# Altium schematic sheet MARS_MIO.SchDoc: My title
size A3; Organization: University of California; Address1: 475 Portola Plaza; Address2: Los Angeles, CA 90095; Revision: R01; SheetNumber: 1; SheetTotal: 1
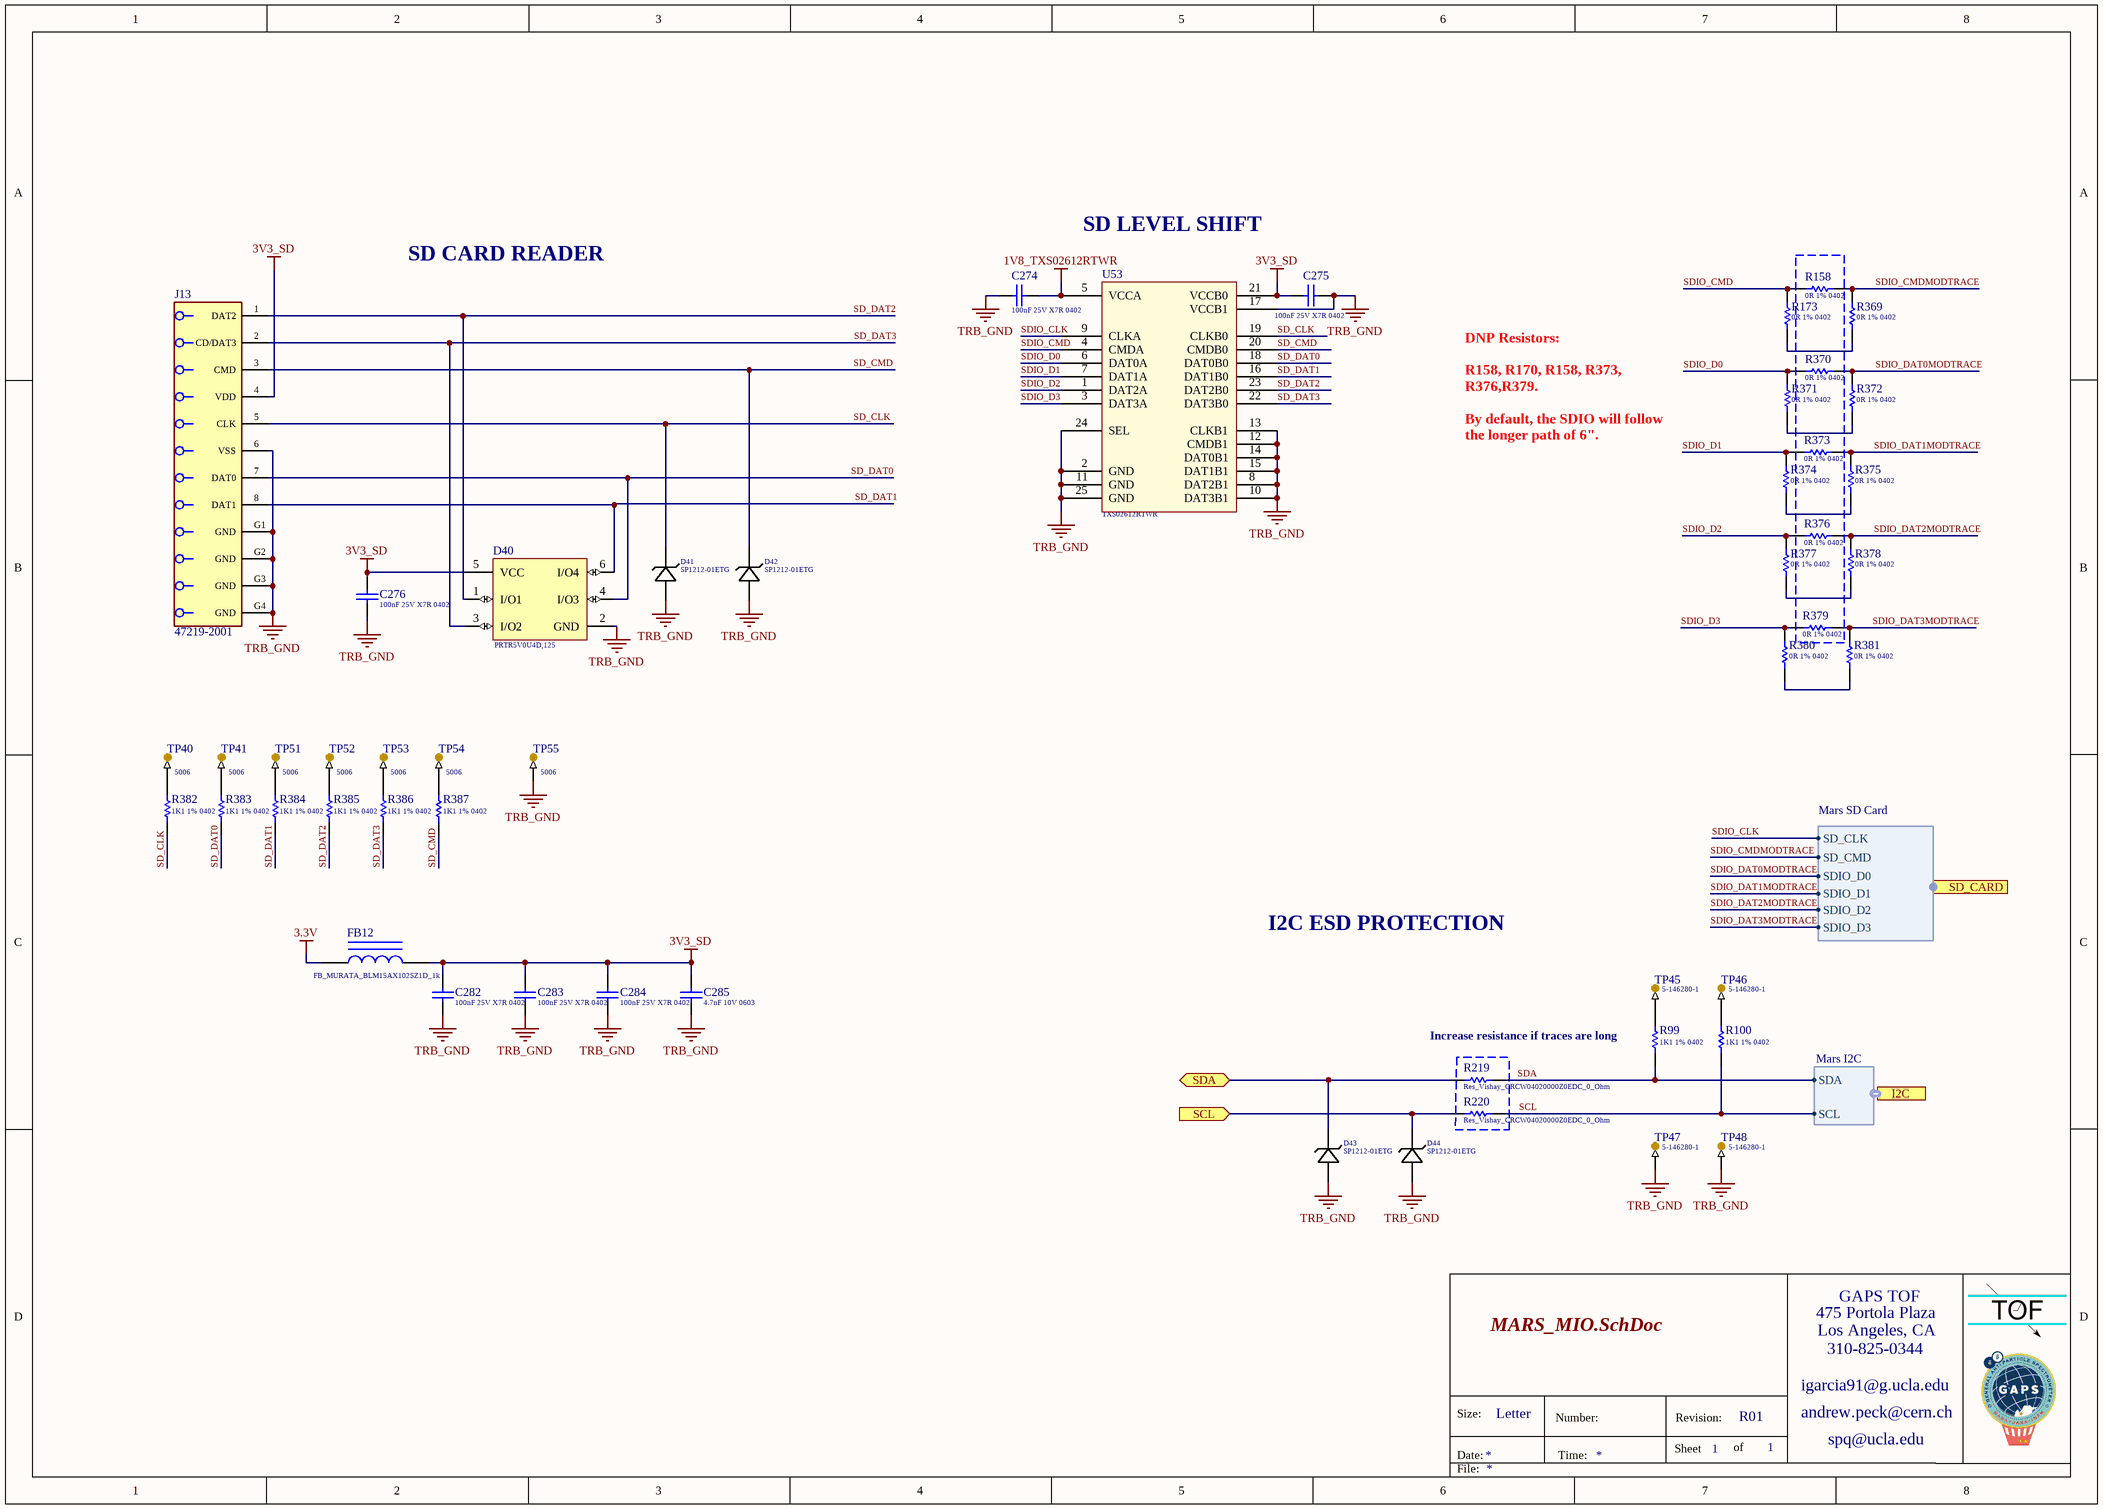
[diagram p0: MARS_MIO.SchDoc]

## Parts
C274  Capacitance: 100nF 25V X7R 0402  [Cap_Taiyo_Yuden_TMK105B7104KV-FR_100nF]  (hidden comment: Cap_Taiyo_Yuden_TMK105B7104KV-FR_100nF)
C275  Capacitance: 100nF 25V X7R 0402  [Cap_Taiyo_Yuden_TMK105B7104KV-FR_100nF]  (hidden comment: Cap_Taiyo_Yuden_TMK105B7104KV-FR_100nF)
C276  Capacitance: 100nF 25V X7R 0402  [Cap_Taiyo_Yuden_TMK105B7104KV-FR_100nF]  (hidden comment: Cap_Taiyo_Yuden_TMK105B7104KV-FR_100nF)
C282  Capacitance: 100nF 25V X7R 0402  [Cap_Taiyo_Yuden_TMK105B7104KV-FR_100nF]  (hidden comment: Cap_Taiyo_Yuden_TMK105B7104KV-FR_100nF)
C283  Capacitance: 100nF 25V X7R 0402  [Cap_Taiyo_Yuden_TMK105B7104KV-FR_100nF]  (hidden comment: Cap_Taiyo_Yuden_TMK105B7104KV-FR_100nF)
C284  Capacitance: 100nF 25V X7R 0402  [Cap_Taiyo_Yuden_TMK105B7104KV-FR_100nF]  (hidden comment: Cap_Taiyo_Yuden_TMK105B7104KV-FR_100nF)
C285  4.7nF 10V 0603  [CAPC0603(1608)100_L]
D40  PRTR5V0U4D,125  [PRTR5V0U4D,125]
D41  Series: SP1212-01ETG  [5V_ESD_Littlefuse_SP1212-01ETG_30kV]  (hidden comment: 5V_ESD_Littlefuse_SP1212-01ETG_30kV)
D42  Series: SP1212-01ETG  [5V_ESD_Littlefuse_SP1212-01ETG_30kV]  (hidden comment: 5V_ESD_Littlefuse_SP1212-01ETG_30kV)
D43  Series: SP1212-01ETG  [5V_ESD_Littlefuse_SP1212-01ETG_30kV]  (hidden comment: 5V_ESD_Littlefuse_SP1212-01ETG_30kV)
D44  Series: SP1212-01ETG  [5V_ESD_Littlefuse_SP1212-01ETG_30kV]  (hidden comment: 5V_ESD_Littlefuse_SP1212-01ETG_30kV)
FB12  FB_MURATA_BLM15AX102SZ1D_1k  [FB_MURATA_BLM15AX102SZ1D_1k]
J13  Part Number: 47219-2001  [Molex_47219-2001_0]  (hidden comment: Conn_Molex_47219-2001_eec)
R99  1K1 1% 0402  [RESC0402(1005)_L]
R100  1K1 1% 0402  [RESC0402(1005)_L]
R158  Resistance: 0R 1% 0402  [Res_Vishay_CRCW04020000Z0EDC_0_Ohm]  (hidden comment: Res_Vishay_CRCW04020000Z0EDC_0_Ohm)
R173  Resistance: 0R 1% 0402  [Res_Vishay_CRCW04020000Z0EDC_0_Ohm]  (hidden comment: Res_Vishay_CRCW04020000Z0EDC_0_Ohm)
R219  Res_Vishay_CRCW04020000Z0EDC_0_Ohm  [Res_Vishay_CRCW04020000Z0EDC_0_Ohm]
R220  Res_Vishay_CRCW04020000Z0EDC_0_Ohm  [Res_Vishay_CRCW04020000Z0EDC_0_Ohm]
R369  Resistance: 0R 1% 0402  [Res_Vishay_CRCW04020000Z0EDC_0_Ohm]  (hidden comment: Res_Vishay_CRCW04020000Z0EDC_0_Ohm)
R370  Resistance: 0R 1% 0402  [Res_Vishay_CRCW04020000Z0EDC_0_Ohm]  (hidden comment: Res_Vishay_CRCW04020000Z0EDC_0_Ohm)
R371  Resistance: 0R 1% 0402  [Res_Vishay_CRCW04020000Z0EDC_0_Ohm]  (hidden comment: Res_Vishay_CRCW04020000Z0EDC_0_Ohm)
R372  Resistance: 0R 1% 0402  [Res_Vishay_CRCW04020000Z0EDC_0_Ohm]  (hidden comment: Res_Vishay_CRCW04020000Z0EDC_0_Ohm)
R373  Resistance: 0R 1% 0402  [Res_Vishay_CRCW04020000Z0EDC_0_Ohm]  (hidden comment: Res_Vishay_CRCW04020000Z0EDC_0_Ohm)
R374  Resistance: 0R 1% 0402  [Res_Vishay_CRCW04020000Z0EDC_0_Ohm]  (hidden comment: Res_Vishay_CRCW04020000Z0EDC_0_Ohm)
R375  Resistance: 0R 1% 0402  [Res_Vishay_CRCW04020000Z0EDC_0_Ohm]  (hidden comment: Res_Vishay_CRCW04020000Z0EDC_0_Ohm)
R376  Resistance: 0R 1% 0402  [Res_Vishay_CRCW04020000Z0EDC_0_Ohm]  (hidden comment: Res_Vishay_CRCW04020000Z0EDC_0_Ohm)
R377  Resistance: 0R 1% 0402  [Res_Vishay_CRCW04020000Z0EDC_0_Ohm]  (hidden comment: Res_Vishay_CRCW04020000Z0EDC_0_Ohm)
R378  Resistance: 0R 1% 0402  [Res_Vishay_CRCW04020000Z0EDC_0_Ohm]  (hidden comment: Res_Vishay_CRCW04020000Z0EDC_0_Ohm)
R379  Resistance: 0R 1% 0402  [Res_Vishay_CRCW04020000Z0EDC_0_Ohm]  (hidden comment: Res_Vishay_CRCW04020000Z0EDC_0_Ohm)
R380  Resistance: 0R 1% 0402  [Res_Vishay_CRCW04020000Z0EDC_0_Ohm]  (hidden comment: Res_Vishay_CRCW04020000Z0EDC_0_Ohm)
R381  Resistance: 0R 1% 0402  [Res_Vishay_CRCW04020000Z0EDC_0_Ohm]  (hidden comment: Res_Vishay_CRCW04020000Z0EDC_0_Ohm)
R382  1K1 1% 0402  [RESC0402(1005)_L]
R383  1K1 1% 0402  [RESC0402(1005)_L]
R384  1K1 1% 0402  [RESC0402(1005)_L]
R385  1K1 1% 0402  [RESC0402(1005)_L]
R386  1K1 1% 0402  [RESC0402(1005)_L]
R387  1K1 1% 0402  [RESC0402(1005)_L]
TP40  Series: 5006  [TP_Keystone_Electronics_5006]  (hidden comment: TP_Keystone_Electronics_5006)
TP41  Series: 5006  [TP_Keystone_Electronics_5006]  (hidden comment: TP_Keystone_Electronics_5006)
TP45  Series: 5-146280-1  [TP_TE_Connectivity_5-146280-1_1POS]  (hidden comment: TP_TE_Connectivity_5-146280-1_1POS)
TP46  Series: 5-146280-1  [TP_TE_Connectivity_5-146280-1_1POS]  (hidden comment: TP_TE_Connectivity_5-146280-1_1POS)
TP47  Series: 5-146280-1  [TP_TE_Connectivity_5-146280-1_1POS]  (hidden comment: TP_TE_Connectivity_5-146280-1_1POS)
TP48  Series: 5-146280-1  [TP_TE_Connectivity_5-146280-1_1POS]  (hidden comment: TP_TE_Connectivity_5-146280-1_1POS)
TP51  Series: 5006  [TP_Keystone_Electronics_5006]  (hidden comment: TP_Keystone_Electronics_5006)
TP52  Series: 5006  [TP_Keystone_Electronics_5006]  (hidden comment: TP_Keystone_Electronics_5006)
TP53  Series: 5006  [TP_Keystone_Electronics_5006]  (hidden comment: TP_Keystone_Electronics_5006)
TP54  Series: 5006  [TP_Keystone_Electronics_5006]  (hidden comment: TP_Keystone_Electronics_5006)
TP55  Series: 5006  [TP_Keystone_Electronics_5006]  (hidden comment: TP_Keystone_Electronics_5006)
U53  Series: TXS02612RTWR  [IC_TXS02612RTWR_SD_Level_Shifter]  (hidden comment: IC_TXS02612RTWR_SD_Level_Shifter)

## Ports
I2C (harness Mars I2C), SCL (in), SD_CARD (harness Mars SD Card), SDA (bidir)

## Harnesses
Mars SD Card: SDIO_D2, SDIO_D1, SDIO_D0, SD_CMD, SD_CLK, SDIO_D3
Mars I2C: SCL, SDA

## Nets
1V8_TXS02612RTWR: C274.1 U53.5(VCCA)
3.3V: FB12.1
3V3_SD: C275.2 C276.2 C282.2 C283.2 C284.2 C285.1 D40.5(VCC) FB12.2 J13.4(VDD) U53.21(VCCB0)
TRB_GND: C274.2 C275.1 C276.1 C282.1 C283.1 C284.1 C285.2 D40.2(GND) D41.2 D42.2 D43.2 D44.2 J13.6(VSS) J13.G1(GND) J13.G2(GND) J13.G3(GND) J13.G4(GND) TP47.1 TP48.1 TP55.1 U53.2(GND) U53.8(DAT2B1) U53.10(DAT3B1) U53.11(GND) U53.12(CMDB1) U53.13(CLKB1) U53.14(DAT0B1) U53.15(DAT1B1) U53.17(VCCB1) U53.24(SEL) U53.25(GND)
SCL: D44.1 R220.2 ; port SCL
SCL: R100.1 R220.1 ; port I2C.SCL  [a separate net that carries the same name]
SD_CLK: D41.1 J13.5(CLK) R382.1 U53.19(CLKB0)
SD_CMD: D42.1 J13.3(CMD) R387.1 U53.20(CMDB0)
SD_DAT0: D40.4(I/O3) J13.7(DAT0) R383.1 U53.18(DAT0B0)
SD_DAT1: D40.6(I/O4) J13.8(DAT1) R384.1 U53.16(DAT1B0)
SD_DAT2: D40.1(I/O1) J13.1(DAT2) R385.1 U53.23(DAT2B0)
SD_DAT3: D40.3(I/O2) J13.2(CD/DAT3) R386.1 U53.22(DAT3B0)
SDA: D43.1 R219.2 ; port SDA
SDA: R99.1 R219.1 ; port I2C.SDA  [a separate net that carries the same name]
SDIO_CLK: U53.9(CLKA) ; port SD_CARD.SD_CLK
SDIO_CMD: R158.1 R173.2 U53.4(CMDA)
SDIO_CMDMODTRACE: R158.2 R369.2 ; port SD_CARD.SD_CMD
SDIO_D0: R370.1 R371.2 U53.6(DAT0A)
SDIO_D1: R373.1 R374.2 U53.7(DAT1A)
SDIO_D2: R376.1 R377.2 U53.1(DAT2A)
SDIO_D3: R379.1 R380.2 U53.3(DAT3A)
SDIO_DAT0MODTRACE: R370.2 R372.2 ; port SD_CARD.SDIO_D0
SDIO_DAT1MODTRACE: R373.2 R375.2 ; port SD_CARD.SDIO_D1
SDIO_DAT2MODTRACE: R376.2 R378.2 ; port SD_CARD.SDIO_D2
SDIO_DAT3MODTRACE: R379.2 R381.2 ; port SD_CARD.SDIO_D3
NetR99_2: R99.2 TP45.1
NetR100_2: R100.2 TP46.1
NetR173_1: R173.1 R369.1
NetR371_1: R371.1 R372.1
NetR374_1: R374.1 R375.1
NetR377_1: R377.1 R378.1
NetR380_1: R380.1 R381.1
NetR382_2: R382.2 TP40.1
NetR383_2: R383.2 TP41.1
NetR384_2: R384.2 TP51.1
NetR385_2: R385.2 TP52.1
NetR386_2: R386.2 TP53.1
NetR387_2: R387.2 TP54.1

## Notes on the sheet
- SD LEVEL SHIFT
- SD CARD READER
- DNP Resistors:
  R158, R170, R158, R373, R376,R379.
  By default, the SDIO will follow the longer path of 6".
- I2C ESD PROTECTION
- (near R99) Increase resistance if traces are long
- 475 Portola Plaza
- GAPS TOF
- igarcia91@g.ucla.edu
- Los Angeles, CA
- 310-825-0344
- Size:
- Date:
- Letter
- Number:
- Time:
- Sheet
- Revision:
- of
- andrew.peck@cern.ch
- spq@ucla.edu
- File:

## Library data of the parts
C274-C276 C282-C284 = Cap_Taiyo_Yuden_TMK105B7104KV-FR_100nF: CAP CER 100nF 25V X7R 0402; Supplier 1: Mouser; Supplier Part Number 1: 963-TMK105B7104KV-FR
C285 = CMP-1035-02189-1: CAP 4.7nF 10V ±10% 0603 (1608 Metric) Thickness 1mm SMD; Case-Metric: 1608; Tolerance: Â±10%; Case-EIA: 0603; Max Thickness: 1 mm; Technology: SMT; Rated Voltage: 10 V; Value: 4.7nF
D40 = PRTR5V0U4D,125: ESD Suppressors / TVS Diodes 5.5V QUAD R-R ESD ULTRA LOW CAP; Supplier 1: Mouser; Supplier Part Number 1: 771-PRTR5V0U4D-T/R
D41-D44 = 5V_ESD_Littlefuse_SP1212-01ETG_30kV: ESD Suppressors / TVS Diodes 5V 12A 30KV UNI-DIR; Supplier 1: Mouser; Supplier Part Number 1: 576-SP1212-01ETG
FB12 = FB_MURATA_BLM15AX102SZ1D_1k: FB SMD 1000 OHM 25% 3/4W 0402; Supplier Part Number 1: 81-BLM15AX102SZ1D; Supplier 1: Mouser
J13 = Conn_Molex_47219-2001_eec: CONN MICRO SD CARD HINGED TYPE; Manufacturer: Molex; Is Female: yes; helpURL: https://upverter.com/upn/revision/cf639670a30b6b80/; ComponentLink2Description: Datasheet; Temperature: -20°C to +85°C; Package: SMT_SDCARD_14MM5_13MM6; Supplier 2: Mouser; Supplier 1: Digi-Key; ComponentLink1URL: https://upverter.com/upn/revision/cf639670a30b6b80/; Supplier Part Number 2: 538-47219-2001; Supplier Part Number 1: WM6698CT-ND; ComponentLink1Description: Upverter; ComponentLink2URL: http://www.molex.com/pdm_docs/sd/472192001_sd.pdf; RoHS: TRUE; Mouser Part Number: 538-47219-2001; Temperature Range High: +85°C; Digikey Description: CONN MICRO SD CARD HINGED TYPE; Digikey Part Number: WM6698CT-ND; Lead Free: yes; Temperature Range Low: -20°C
R99 R100 R382-R387 = CMP-1011-00514-1: 1K1 0.063W 1% 0402 (1005 Metric)  SMD; Case-Metric: 1005; Case-EIA: 0402; Value: 1100.00 Ohm; Power: 0.063 W; Tolerance: 1 %; Technology: SMT
R158 R173 R369-R381 = Res_Vishay_CRCW04020000Z0EDC_0_Ohm: 0R 0.062W 1% 0402 (1005 Metric)  SMD; Supplier 1: Mouser; Supplier Part Number 1: 71-CRCW04020000Z0EDC
R219 R220 = Res_Vishay_CRCW04020000Z0EDC_0_Ohm: 0R 0.062W 1% 0402 (1005 Metric)  SMD; Resistance: 0R 1% 0402; Supplier 1: Mouser; Supplier Part Number 1: 71-CRCW04020000Z0EDC
TP40 TP41 TP51-TP55 = TP_Keystone_Electronics_5006: Circuit Board Hardware - PCB TEST POINT BLK .063; Supplier 1: Mouser; Supplier Part Number 1: 534-5006
TP45-TP48 = TP_TE_Connectivity_5-146280-1_1POS: Headers & Wire Housings Unshrouded 1 POS T/H; Supplier Part Number 1: 571-51462801; Supplier 1: Mouser
U53 = IC_TXS02612RTWR_SD_Level_Shifter: Interface - I/O Expanders SDIO Port Expander; Supplier Part Number 1: 595-TXS02612RTWR; Supplier 1: Mouser